# Altium schematic sheet Laser_V-I_Transform.SchDoc
size A4; SheetNumber: 2; SheetTotal: 4
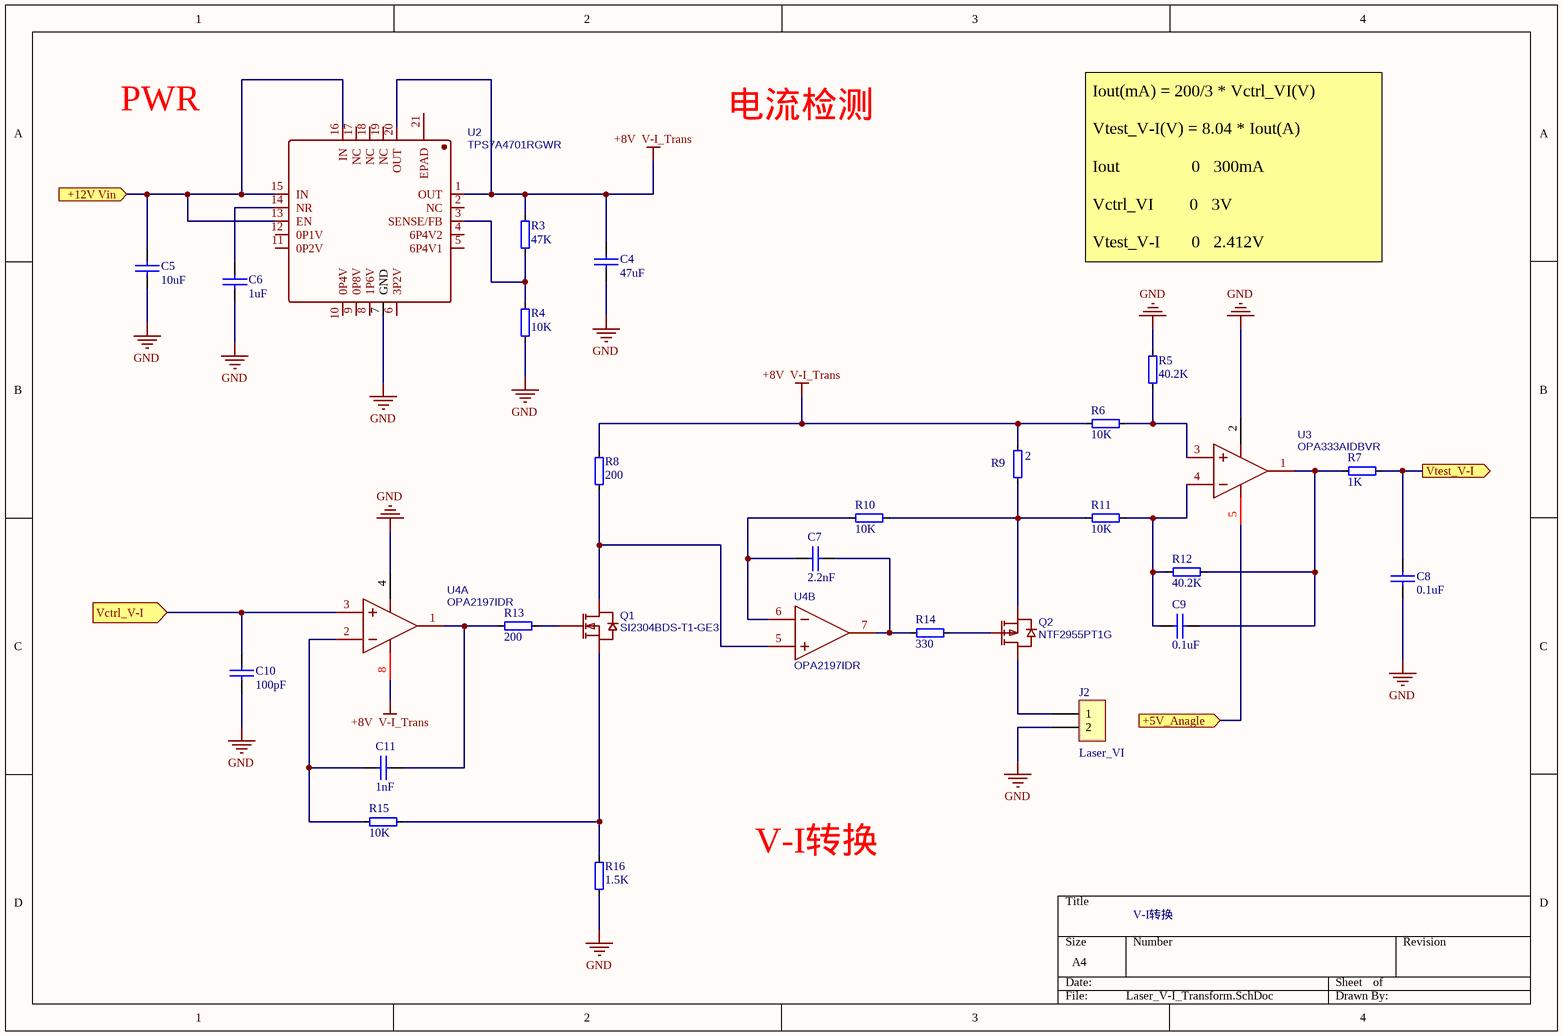
[diagram p0: Laser_V-I_Transform.SchDoc]

## Parts
C4  47uF  [C 0603_M]
C5  10uF  [C 0603_M]
C6  1uF  [C 0603_M]
C7  2.2nF  [C 0603_M]
C8  0.1uF  [C 0603_M]
C9  0.1uF  [C 0603_M]
C10  100pF  [C 0603_M]
C11  1nF  [C 0603_M]
J2  Laser_VI  [KF128-5.08-2P]
Q1  SI2304BDS-T1-GE3  [SOT-23_L2.9-W1.3-P1.90-LS2.4-BR]
Q2  NTF2955PT1G  [SOT-223-4_L6.5-W3.5-P2.30-LS7.0-BR]
R3  47K  [0603R]
R4  10K  [0603R]
R5  40.2K  [0603R]
R6  10K  [0603R]
R7  1K  [0603R]
R8  200  [0603R]
R9  2  [0603R]
R10  10K  [0603R]
R11  10K  [0603R]
R12  40.2K  [0603R]
R13  200  [0603R]
R14  330  [0603R]
R15  10K  [0603R]
R16  1.5K  [0603R]
U2  TPS7A4701RGWR  [VQFN-20_L5.0-W5.0-P0.65-TL-EP]
U3  OPA333AIDBVR  [SOT-23-5_L3.0-W1.7-P0.95-LS2.8-BR]
U4  OPA2197IDR  [SOIC-8_L4.9-W3.9-P1.27-LS6.0-BL]  (parts A,B of 2)

## Ports
+5V_Anagle (in), +12V Vin (in), Vctrl_V-I (in), Vtest_V-I (out)

## Nets
+8V  V-I_Trans: C4.2 R3.2 R6.1 R8.1 R9.1 U2.1(OUT) U2.20(OUT) U4.8(V+)
GND: C4.1 C5.2 C6.2 C8.2 C10.1 J2.2 R4.1 R5.2 R16.2 U2.7(GND) U3.2(V-) U4.4(V-)
+5V_Anagle: U3.5(V+) ; port +5V_Anagle
+12V Vin: C5.1 U2.13(EN) U2.15(IN) U2.16(IN) ; port +12V Vin
Vctrl_V-I: C10.2 U4.3(IN_A+) ; port Vctrl_V-I
Vtest_V-I: C8.1 R7.2 ; port Vtest_V-I
NetC6_1: C6.1 U2.14(NR)
NetC7_1: C7.1 R14.2 U4.7(OUT_A)
NetC7_2: C7.2 R10.1 U4.6(IN_A-)
NetC9_1: C9.1 R7.1 R12.2 U3.1(OUT)
NetC9_2: C9.2 R11.2 R12.1 U3.4(IN-)
NetC11_1: C11.1 R13.2 U4.1(OUT_A)
NetC11_2: C11.2 R15.2 U4.2(IN_A-)
NetJ2_1: J2.1 Q2.2(D)
NetQ1_1: Q1.1(G) R13.1
NetQ1_2: Q1.2(S) R15.1 R16.1
NetQ1_3: Q1.3(D) R8.2 U4.5(IN_A+)
NetQ2_1: Q2.1(G) R14.1
NetQ2_3: Q2.3(S) R9.2 R10.2 R11.1
NetR3_1: R3.1 R4.2 U2.3(SENSE/FB)
NetR5_1: R5.1 R6.2 U3.3(IN+)

Not connected (* = marked no-connect by the designer): U2 2(NC) 4(6P4V2) 5(6P4V1) 6(3P2V) 8(1P6V) 9(0P8V) 10(0P4V) 11(0P2V) 12(0P1V) 17(NC) 18(NC) 19(NC) 21(EPAD)

## Notes on the sheet
- PWR
- 电流检测
- Iout(mA) = 200/3 * Vctrl_VI(V)
  Vtest_V-I(V) = 8.04 * Iout(A)
  Iout                0   300mA
  Vctrl_VI        0   3V
  Vtest_V-I       0   2.412V
- V-I转换

## Library data of the parts
C4-C11 = 普通电容: Capacitor
J2 = SIP2: jointbar
Q1 = SI2304BDS-T1-GE3: BOM_Manufacturer: VISHAY; BOM_Supplier: LCSC; BOM_Manufacturer Part: SI2304BDS-T1-GE3; BOM_Supplier Part: C81446; BOM_JLCPCB Part Class: Extended Part; spicePre: Q; spiceSymbolName: SI2304BDS-T1-GE3
Q2 = NTF2955PT1G: BOM_Manufacturer: VBsemi Elec; Contributor: LCSC; BOM_Supplier: LCSC; BOM_Supplier Part: C710036; BOM_Manufacturer Part: NTF2955PT1G; BOM_JLCPCB Part Class: Extended Part; spicePre: Q; spiceSymbolName: NTF2955PT1G
R3 R4 R8 R16 = 普通电阻: 电阻精度为0.1%
R5-R7 R10-R15 = 普通电阻
R9 = 采样电阻: 采样电阻，电阻精度为0.1%
U2 = TPS7A4701RGWR: BOM_Manufacturer: Texas Instruments; Contributor: LCSC; BOM_Supplier: LCSC; BOM_Supplier Part: C90084; BOM_Manufacturer Part: TPS7A4701RGWR; BOM_JLCPCB Part Class: Extended Part; spicePre: U; spiceSymbolName: TPS7A4701RGWR
U3 = OPA333AIDBVR: BOM_Manufacturer: TI; Contributor: LCSC; BOM_Supplier: LCSC; BOM_Manufacturer Part: OPA333AIDBVR; BOM_Supplier Part: C30878; BOM_JLCPCB Part Class: Extended Part; spicePre: U; spiceSymbolName: OPA333AIDBVR
U4 = OPA2197IDR: BOM_Manufacturer: TI; Contributor: LCSC; BOM_Supplier: LCSC; BOM_Manufacturer Part: OPA2197IDR; BOM_Supplier Part: C139363; BOM_JLCPCB Part Class: Extended Part; spicePre: U; spiceSymbolName: OPA2197IDR